# Altium schematic sheet 01_detection_tdc.SchDoc
size A; SheetNumber: 17; SheetTotal: 17
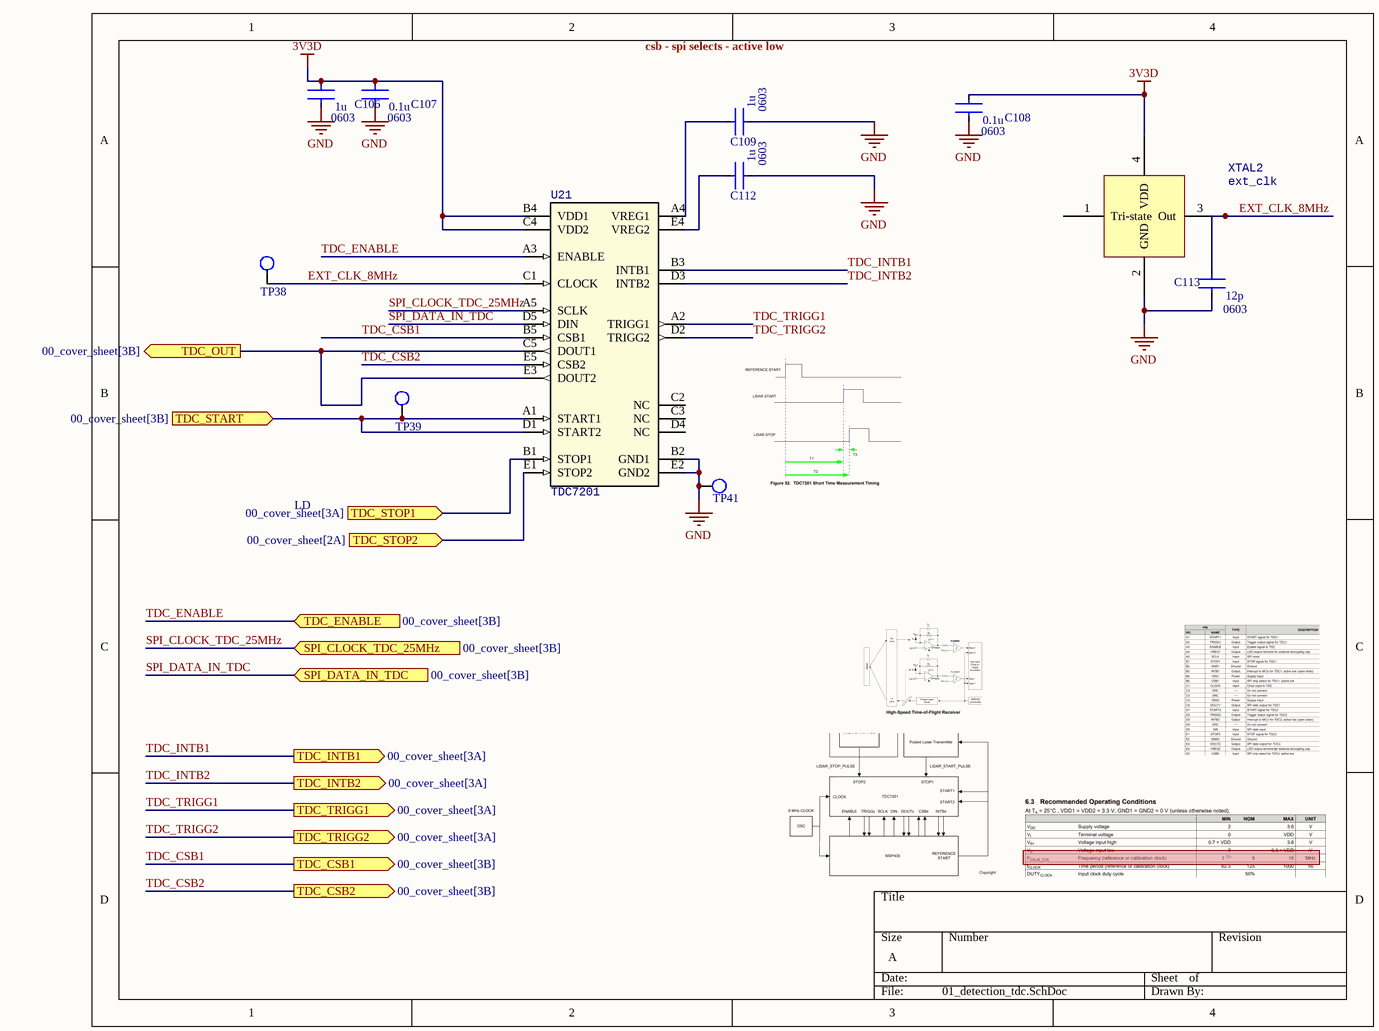
[diagram p0: 01_detection_tdc.SchDoc]

## Parts
C106  C1608X5R1E105K080AC  [CAPTDK0603]  (value not drawn)
C107  CGA3E2X7R1H104K080AA  [CAPTDK0603]  (value not drawn)
C108  CGA3E2X7R1H104K080AA  [CAPTDK0603]  (value not drawn)
C109  C1608X5R1E105K080AC  [CAPTDK0603]  (value not drawn)
C112  C1608X5R1E105K080AC  [CAPTDK0603]  (value not drawn)
C113  CGA3E2C0G1H120J080AA  [CAPTDK0603]  (value not drawn)
TP38  TESTPOINT_S  [TESTPOINT_S]  (value not drawn)  (no BOM)
TP39  TESTPOINT_S  [TESTPOINT_S]  (value not drawn)  (no BOM)
TP41  TESTPOINT_S  [TESTPOINT_S]  (value not drawn)  (no BOM)
U21  TDC7201  [ZAX0025A]
XTAL2  ext_clk  [ECS-2520MV]

## Ports
SPI_CLOCK_TDC_25MHz (in, see 00_cover_sheet[3B]), SPI_DATA_IN_TDC (in, see 00_cover_sheet[3B]), TDC_CSB1 (out, see 00_cover_sheet[3B]), TDC_CSB2 (out, see 00_cover_sheet[3B]), TDC_ENABLE (in, see 00_cover_sheet[3B]), TDC_INTB1 (out, see 00_cover_sheet[3A]), TDC_INTB2 (out, see 00_cover_sheet[3A]), TDC_OUT (out, see 00_cover_sheet[3B]), TDC_START (in, see 00_cover_sheet[3B]), TDC_STOP1 (in, see 00_cover_sheet[3A]), TDC_STOP2 (in, see 00_cover_sheet[2A]), TDC_TRIGG1 (out, see 00_cover_sheet[3A]), TDC_TRIGG2 (out, see 00_cover_sheet[3A])

## Nets
3V3D: C106.1 C107.1 C108.1 U21.B4(VDD1) U21.C4(VDD2) XTAL2.4(VDD)
GND: C106.2 C107.2 C108.2 C109.2 C112.2 C113.2 TP41.1 U21.B2(GND1) U21.E2(GND2) XTAL2.2(GND)
EXT_CLK_8MHz: C113.1 TP38.1 U21.C1(CLOCK) XTAL2.3(Out)
SPI_CLOCK_TDC_25MHz: U21.A5(SCLK) ; port SPI_CLOCK_TDC_25MHz
SPI_DATA_IN_TDC: U21.D5(DIN) ; port SPI_DATA_IN_TDC
TDC_CSB1: U21.B5(CSB1) ; port TDC_CSB1
TDC_CSB2: U21.E5(CSB2) ; port TDC_CSB2
TDC_ENABLE: U21.A3(ENABLE) ; port TDC_ENABLE
TDC_INTB1: U21.B3(INTB1) ; port TDC_INTB1
TDC_INTB2: U21.D3(INTB2) ; port TDC_INTB2
TDC_OUT: U21.C5(DOUT1) U21.E3(DOUT2) ; port TDC_OUT
TDC_START: TP39.1 U21.A1(START1) U21.D1(START2) ; port TDC_START
TDC_STOP1: U21.B1(STOP1) ; port TDC_STOP1
TDC_STOP2: U21.E1(STOP2) ; port TDC_STOP2
TDC_TRIGG1: U21.A2(TRIGG1) ; port TDC_TRIGG1
TDC_TRIGG2: U21.D2(TRIGG2) ; port TDC_TRIGG2
NetC109_1: C109.1 U21.A4(VREG1)
NetC112_1: C112.1 U21.E4(VREG2)

Not connected (* = marked no-connect by the designer): U21 C2(NC) C3(NC) D4(NC); XTAL2 1(Tri-state)

## Notes on the sheet
- csb - spi selects - active low
- LD
- (in symbol C1608X5R1E105K080AC) 1u; 0603
- (in symbol CGA3E2C0G1H120J080AA) 12p; 0603
- (in symbol CGA3E2X7R1H104K080AA) 0.1u; 0603

## Library data of the parts
C106 C109 C112 = C1608X5R1E105K080AC: CAP CER 1UF 25V X5R 0603; Supplier 1: Digi-Key; Supplier Part Number 1: 445-5146-1-ND
C107 C108 = CGA3E2X7R1H104K080AA: CAP CER 0.1UF 50V X7R 0603; Supplier 1: Digi-Key; Supplier Part Number 1: 445-5666-1-ND
C113 = CGA3E2C0G1H120J080AA: CAP CER 12PF 50V C0G 0603; Supplier 1: Digi-Key; Supplier Part Number 1: 445-5629-1-ND
TP38 TP39 TP41 = TESTPOINT_S: Testpoint Surface Pad
U21 = TDC7201: IC TIME TO DIGITAL CONV 25-NFBGA; Supplier 1: Digikey; Supplier Part Number 1: 296-48679-1-ND
XTAL2 = ECS-2520MV-160-CN-TR: OSC XO 16.0000MHZ CMOS SMD; Supplier 1: Digikey; Supplier Part Number 1: XC3030CT-ND